# Altium schematic sheet spartan6-2.SchDoc
size 389 x 250 mm; SheetNumber: 3; SheetTotal: 8
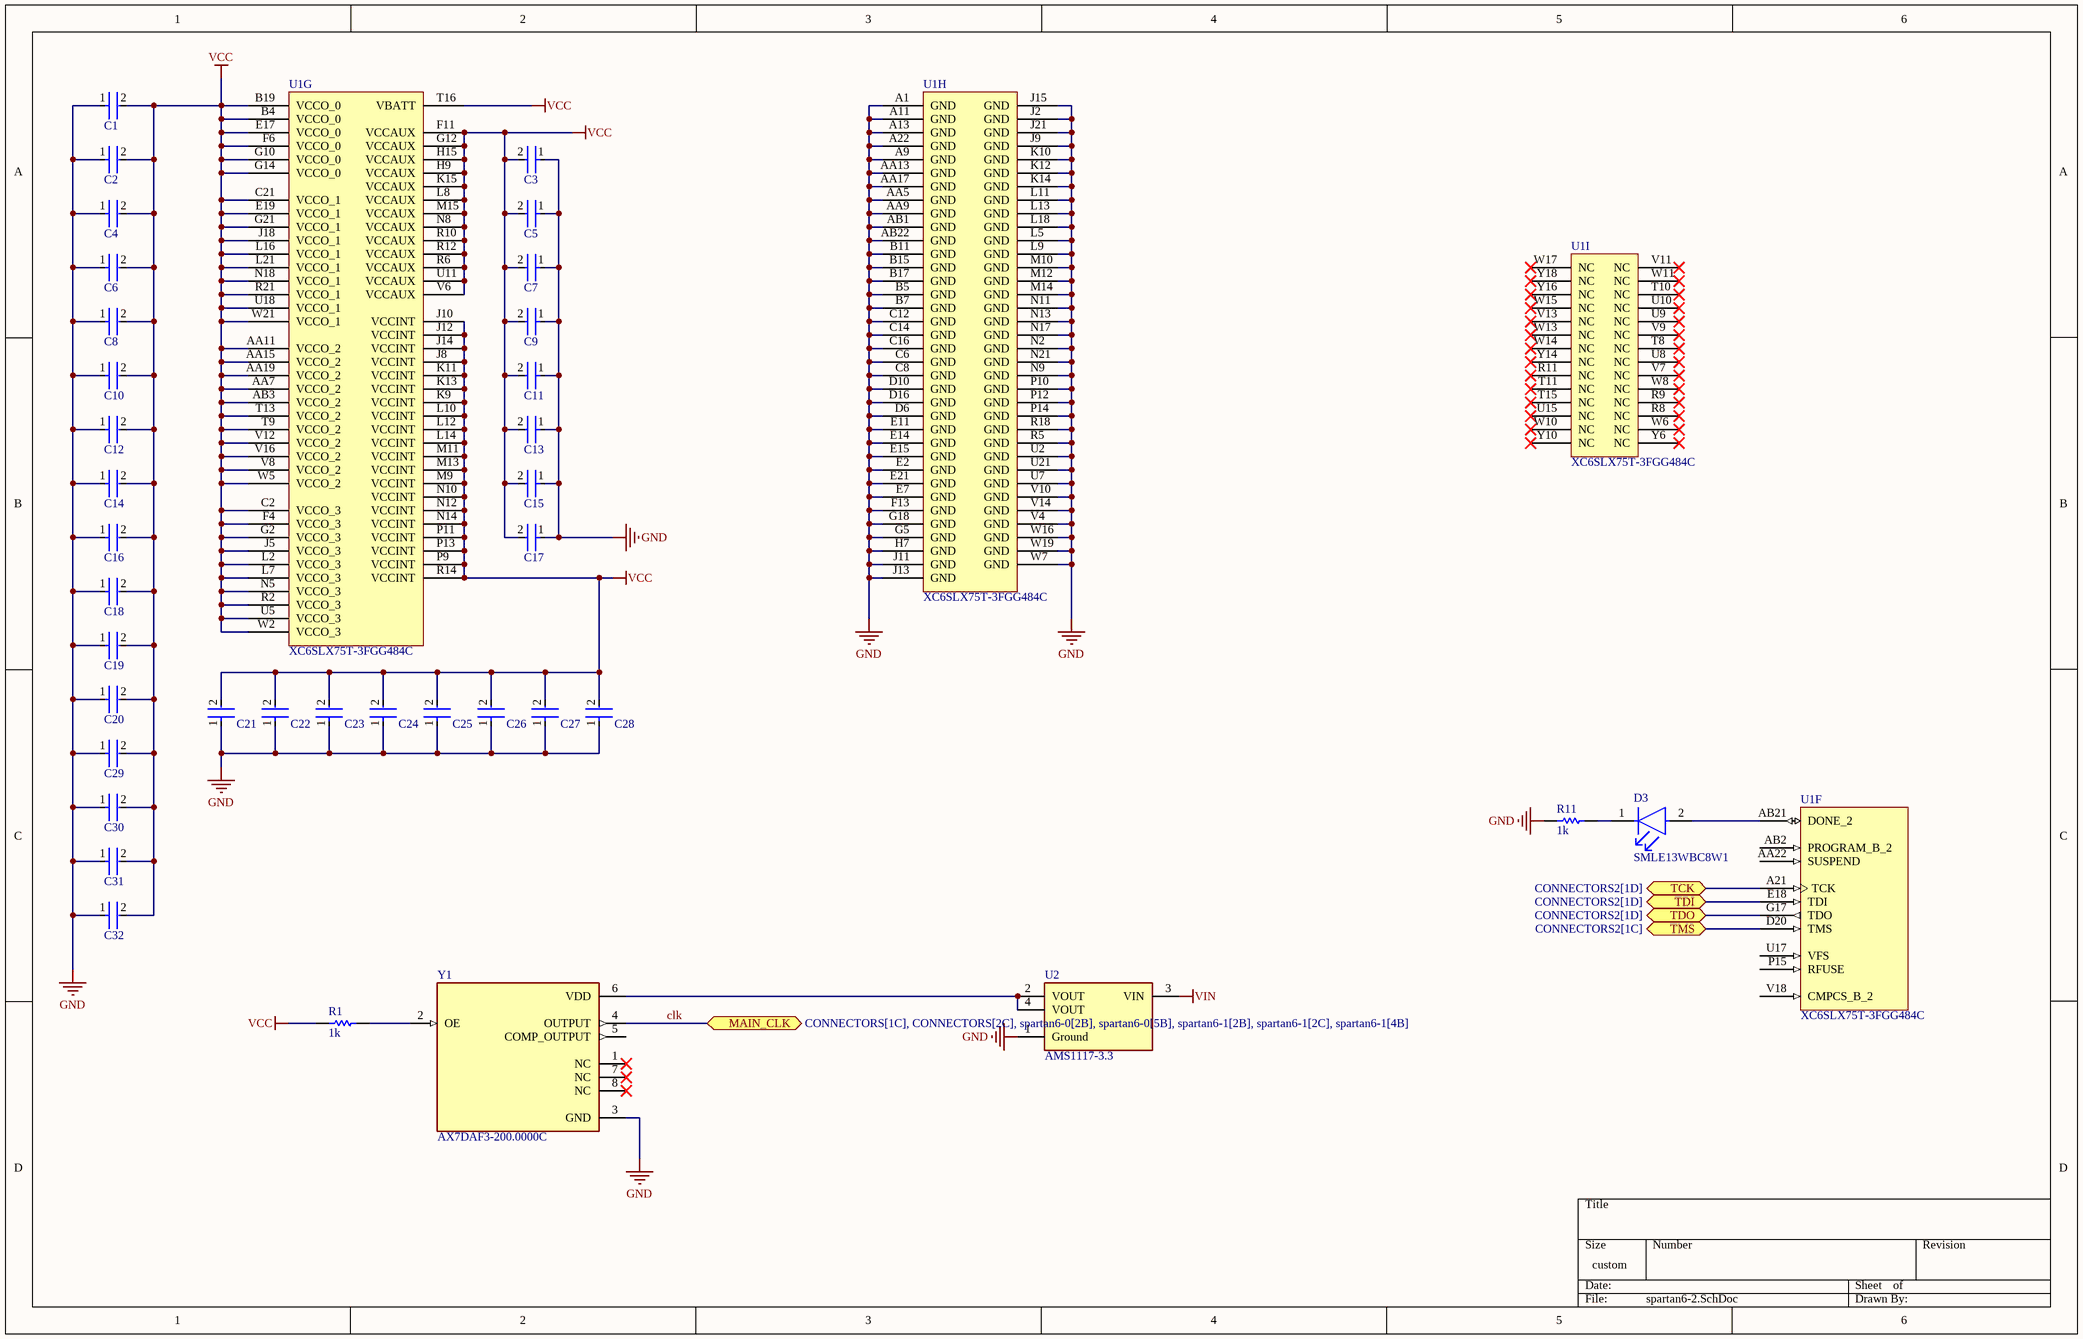
[diagram p0: spartan6-2.SchDoc]

## Parts
C1  C0603X6S0G474M030BC  [FP-C0603-030-0_03-MFG]  (value not drawn)
C2  C0603X6S0G474M030BC  [FP-C0603-030-0_03-MFG]  (value not drawn)
C3  C0603X6S0G474M030BC  [FP-C0603-030-0_03-MFG]  (value not drawn)
C4  C0603X6S0G474M030BC  [FP-C0603-030-0_03-MFG]  (value not drawn)
C5  C0603X6S0G474M030BC  [FP-C0603-030-0_03-MFG]  (value not drawn)
C6  C0603X6S0G474M030BC  [FP-C0603-030-0_03-MFG]  (value not drawn)
C7  C0603X6S0G474M030BC  [FP-C0603-030-0_03-MFG]  (value not drawn)
C8  C0603X6S0G474M030BC  [FP-C0603-030-0_03-MFG]  (value not drawn)
C9  C0603X6S0G474M030BC  [FP-C0603-030-0_03-MFG]  (value not drawn)
C10  C0603X6S0G474M030BC  [FP-C0603-030-0_03-MFG]  (value not drawn)
C11  C0603X6S0G474M030BC  [FP-C0603-030-0_03-MFG]  (value not drawn)
C12  C0603X6S0G474M030BC  [FP-C0603-030-0_03-MFG]  (value not drawn)
C13  C0603X6S0G474M030BC  [FP-C0603-030-0_03-MFG]  (value not drawn)
C14  C0603X6S0G474M030BC  [FP-C0603-030-0_03-MFG]  (value not drawn)
C15  C0603X6S0G474M030BC  [FP-C0603-030-0_03-MFG]  (value not drawn)
C16  C0603X6S0G474M030BC  [FP-C0603-030-0_03-MFG]  (value not drawn)
C17  C0603X6S0G474M030BC  [FP-C0603-030-0_03-MFG]  (value not drawn)
C18  C0603X6S0G474M030BC  [FP-C0603-030-0_03-MFG]  (value not drawn)
C19  C0603X6S0G474M030BC  [FP-C0603-030-0_03-MFG]  (value not drawn)
C20  C0603X6S0G474M030BC  [FP-C0603-030-0_03-MFG]  (value not drawn)
C21  C0603X6S0G474M030BC  [FP-C0603-030-0_03-MFG]  (value not drawn)
C22  C0603X6S0G474M030BC  [FP-C0603-030-0_03-MFG]  (value not drawn)
C23  C0603X6S0G474M030BC  [FP-C0603-030-0_03-MFG]  (value not drawn)
C24  C0603X6S0G474M030BC  [FP-C0603-030-0_03-MFG]  (value not drawn)
C25  C0603X6S0G474M030BC  [FP-C0603-030-0_03-MFG]  (value not drawn)
C26  C0603X6S0G474M030BC  [FP-C0603-030-0_03-MFG]  (value not drawn)
C27  C0603X6S0G474M030BC  [FP-C0603-030-0_03-MFG]  (value not drawn)
C28  C0603X6S0G474M030BC  [FP-C0603-030-0_03-MFG]  (value not drawn)
C29  C0603X6S0G474M030BC  [FP-C0603-030-0_03-MFG]  (value not drawn)
C30  C0603X6S0G474M030BC  [FP-C0603-030-0_03-MFG]  (value not drawn)
C31  C0603X6S0G474M030BC  [FP-C0603-030-0_03-MFG]  (value not drawn)
C32  C0603X6S0G474M030BC  [FP-C0603-030-0_03-MFG]  (value not drawn)
D3  SMLE13WBC8W1  [FP-SMLE13WBC8W1-MFG]
R1  1k  [RESC2013X60X35ML10T20]
R11  1k  [RESC2013X60X35ML10T20]
U1  XC6SLX75T-3FGG484C  [FGG484]  (parts F,G,H,I of 9)
U2  AMS1117-3.3  [FP-AMS1117-IPC_C]
Y1  AX7DAF3-200.0000C  [OSC_AX7DAF3-200.0000C]

## Ports
MAIN_CLK (bidir, see CONNECTORS[1C], CONNECTORS[2C], spartan6-0[2B], spartan6-0[5B], spartan6-1[2B], spartan6-1[2C], spartan6-1[4B]), TCK (bidir, see CONNECTORS2[1D]), TDI (bidir, see CONNECTORS2[1D]), TDO (bidir, see CONNECTORS2[1D]), TMS (bidir, see CONNECTORS2[1C])

## Nets
GND: C1.1 C2.1 C3.1 C4.1 C5.1 C6.1 C7.1 C8.1 C9.1 C10.1 C11.1 C12.1 C13.1 C14.1 C15.1 C16.1 C17.1 C18.1 C19.1 C20.1 C21.1 C22.1 C23.1 C24.1 C25.1 C26.1 C27.1 C28.1 C29.1 C30.1 C31.1 C32.1 R11.1 U1.A1(GND) U1.A9(GND) U1.A11(GND) U1.A13(GND) U1.A22(GND) U1.AA5(GND) U1.AA9(GND) U1.AA13(GND) U1.AA17(GND) U1.AB1(GND) U1.AB22(GND) U1.B5(GND) U1.B7(GND) U1.B11(GND) U1.B15(GND) U1.B17(GND) U1.C6(GND) U1.C8(GND) U1.C12(GND) U1.C14(GND) U1.C16(GND) U1.D6(GND) U1.D10(GND) U1.D16(GND) U1.E2(GND) U1.E7(GND) U1.E11(GND) U1.E14(GND) U1.E15(GND) U1.E21(GND) U1.F13(GND) U1.G5(GND) U1.G18(GND) U1.H7(GND) U1.J2(GND) U1.J9(GND) U1.J11(GND) U1.J13(GND) U1.J15(GND) U1.J21(GND) U1.K10(GND) U1.K12(GND) U1.K14(GND) U1.L5(GND) U1.L9(GND) U1.L11(GND) U1.L13(GND) U1.L18(GND) U1.M10(GND) U1.M12(GND) U1.M14(GND) U1.N2(GND) U1.N9(GND) U1.N11(GND) U1.N13(GND) U1.N17(GND) U1.N21(GND) U1.P10(GND) U1.P12(GND) U1.P14(GND) U1.R5(GND) U1.R18(GND) U1.U2(GND) U1.U7(GND) U1.U21(GND) U1.V4(GND) U1.V10(GND) U1.V14(GND) U1.W7(GND) U1.W16(GND) U1.W19(GND) U2.1(Ground) Y1.3(GND)
VCC: C1.2 C2.2 C3.2 C4.2 C5.2 C6.2 C7.2 C8.2 C9.2 C10.2 C11.2 C12.2 C13.2 C14.2 C15.2 C16.2 C17.2 C18.2 C19.2 C20.2 C21.2 C22.2 C23.2 C24.2 C25.2 C26.2 C27.2 C28.2 C29.2 C30.2 C31.2 C32.2 R1.1 U1.AA7(VCCO_2) U1.AA11(VCCO_2) U1.AA15(VCCO_2) U1.AA19(VCCO_2) U1.AB3(VCCO_2) U1.B4(VCCO_0) U1.B19(VCCO_0) U1.C2(VCCO_3) U1.C21(VCCO_1) U1.E17(VCCO_0) U1.E19(VCCO_1) U1.F4(VCCO_3) U1.F6(VCCO_0) U1.F11(VCCAUX) U1.G2(VCCO_3) U1.G10(VCCO_0) U1.G12(VCCAUX) U1.G14(VCCO_0) U1.G21(VCCO_1) U1.H9(VCCAUX) U1.H15(VCCAUX) U1.J5(VCCO_3) U1.J8(VCCINT) U1.J10(VCCINT) U1.J12(VCCINT) U1.J14(VCCINT) U1.J18(VCCO_1) U1.K9(VCCINT) U1.K11(VCCINT) U1.K13(VCCINT) U1.K15(VCCAUX) U1.L2(VCCO_3) U1.L7(VCCO_3) U1.L8(VCCAUX) U1.L10(VCCINT) U1.L12(VCCINT) U1.L14(VCCINT) U1.L16(VCCO_1) U1.L21(VCCO_1) U1.M9(VCCINT) U1.M11(VCCINT) U1.M13(VCCINT) U1.M15(VCCAUX) U1.N5(VCCO_3) U1.N8(VCCAUX) U1.N10(VCCINT) U1.N12(VCCINT) U1.N14(VCCINT) U1.N18(VCCO_1) U1.P9(VCCINT) U1.P11(VCCINT) U1.P13(VCCINT) U1.R2(VCCO_3) U1.R6(VCCAUX) U1.R10(VCCAUX) U1.R12(VCCAUX) U1.R14(VCCINT) U1.R21(VCCO_1) U1.T9(VCCO_2) U1.T13(VCCO_2) U1.T16(VBATT) U1.U5(VCCO_3) U1.U11(VCCAUX) U1.U18(VCCO_1) U1.V6(VCCAUX) U1.V8(VCCO_2) U1.V12(VCCO_2) U1.V16(VCCO_2) U1.W2(VCCO_3) U1.W5(VCCO_2) U1.W21(VCCO_1)
VIN: U2.3(VIN)
clk: Y1.4(OUTPUT) ; port MAIN_CLK
TCK: U1.A21(TCK) ; port TCK
TDI: U1.E18(TDI) ; port TDI
TDO: U1.G17(TDO) ; port TDO
TMS: U1.D20(TMS) ; port TMS
NetD3_1: D3.1(C) R11.2
NetD3_2: D3.2(A) U1.AB21(DONE_2)
NetR1_2: R1.2 Y1.2(OE)
NetU2_2: U2.2(VOUT) U2.4(VOUT) Y1.6(VDD)

Not connected (* = marked no-connect by the designer): U1 AA22(SUSPEND) AB2(PROGRAM_B_2) P15(RFUSE) R8(NC)* R9(NC)* R11(NC)* T8(NC)* T10(NC)* T11(NC)* T15(NC)* U8(NC)* U9(NC)* U10(NC)* U15(NC)* U17(VFS) V7(NC)* V9(NC)* V11(NC)* V13(NC)* V18(CMPCS_B_2) W6(NC)* W8(NC)* W10(NC)* W11(NC)* W13(NC)* W14(NC)* W15(NC)* W17(NC)* Y6(NC)* Y10(NC)* Y14(NC)* Y16(NC)* Y18(NC)*; Y1 1(NC)* 5(COMP_OUTPUT) 7(NC)* 8(NC)*

## Library data of the parts
C1-C32 = CMP-08246-002636-1: Multilayer Ceramic Capacitors 470nF ±20% 4V X6S SMD 0201; Dielectric Material: Ceramic; RoHS Compliant: Yes; Case Code (Imperial): 0201; Voltage Rating: 4V; Series: C; Case/Package: 0201; Max Operating Temperature: 105°C; Width: 0.3mm; Termination: SMD/SMT; Lead Free: Lead Free; Capacitance: 470nF; Tolerance: 20%; Mount: Surface Mount; Thickness: 0.013inch; Package Quantity: 15000; Case Code (Metric): 0603; Height: 0.3mm; Weight: 6E-06oz; Length: 0.024inch; Packaging: Tape and Reel; Min Operating Temperature: -55°C; Voltage Rating (DC): 4V; Dielectric: X6S
D3 = CMP-08952-000004-1: LED WHITE 0603 SMD; Manufacturer: Rohm; Luminous Intensity: 140mcd; Led Orientation: Top View; Reverse Voltage: 5V; Forward Voltage: 2.9V; Forward Current: 5mA; Power Dissipation: 66mW; Temperature Range Low: -40°C; Digikey Description: LED WHITE 0603 SMD; Temperature Range High: +85°C; Temperature: -40°C to +85°C; Manufacturer Part Number: SMLE13WBC8W1; Colour: White; Mouser Description: Standard LEDs - SMD ExceLED White LED 120mcd 5mA; Octopart: https://octopart.com/smle13wbc8w1-rohm-22224565; Automotive: No; Device Class L2: LEDs; Lead Free: Yes; ComponentLink2URL: https://media.digikey.com/pdf/Data%20Sheets/Rohm%20PDFs/SMLE13WBC8W1_Spec.pdf; Device Class L3: unset; Package: 0; RoHS: TRUE; Height: 0.4mm; Category: Diode; Device Class L1: Optoelectronics; ComponentLink2Description: Datasheet
R1 R11 = CMP-2100-03673-1: Chip Resistor, 0 Ohm, Jumper, +/- 5%, 0.125 W, -55 to 155 degC, 0805 (2012 Metric), RoHS, Tape and Reel; Manufacturer: Yageo; Power Rating: 125mW; Resistance: 0mOhm; Voltage Rating (DC): 150V; Temperature Coefficient: 200ppm/degreesC; Height: 0.5mm; Depth: 1.25mm; Case Code (Imperial): 0805; Lead Free: LeadFree; Military Standard: Not; Package Description: 2-Pin Surface Mounted Device, Body 2 x 1.25 mm; Case Code (Metric): 2012; Composition: ThickFilm; Voltage Rating: 150V; Manufacturer URL: http://www.yageo.com/; Packaging: TapeandReel; Package Reference: 0805; REACH SVHC: Unknown; Tolerance: 5%; Case/Package: 0805; Max Operating Temperature: 155degC; Number of Pins: 2; Min Operating Temperature: -55degC; RoHSCompliant: true; Length: 2mm; Datasheet URL: http://www.yageo.com/NewPortal/yageodocoutput?fileName=/pdf/R-Chip/PYu-RC_Group_51_RoHS_L_5.pdf; Termination: SMD/SMT; Radiation Hardening: No; Width: 1.25mm; Contact Plating: Tin; Datasheet Version: Rev. 5, 10/2016
U1 = CMP-0067-00082-1: Spartan-6 LXT 1.2V FPGA, 268 User I/Os, 484-Ball Fine-Pitch BGA (1.0mm Pitch), Speed Grade 3, Commercial Grade, Pb-Free; PackageDescription: 484-Ball Fine Pitch Ball Grid Array 1.00 mm Pitch (FGG484) - Pb-Free; PackageVersion: ver1.1, Dec-2008; DatasheetVersion: ver1.6, Nov-2010; Code_JEDEC: MS-034-AAJ-1; Code_IPC: BGA100P22X22-484; PackageReference: FGG484
U2 = CMP-209535-000001-1: LDO Voltage Regulators 1A, 3.3V; Manufacturer: Advanced Monolithic Systems; Dropout Voltage: 1.1V; Output Type: Fixed; Nominal Supply Current: 5mA; Max Power Dissipation: 1.2W; Max Supply Voltage: 15V; Number Of Outputs: 1; Standoff Height: 0.64mm; Max Junction Temp: +125°C; Height: 1.8mm; Package: AMS1117; Device Class L2: Power Management ICs; ComponentLink2Description: Datasheet; ComponentLink2URL: http://www.advanced-monolithic.com/pdf/ds1117.pdf; Category: IC; RoHS: TRUE; Automotive: No; Device Class L1: Integrated Circuits (ICs); Output Current: 1A; Device Class L3: Voltage Regulators - Linear; Temperature: -40°C to +125°C; Output Voltage: 3.3V; Manufacturer Part Number: AMS1117-3.3; Temperature Range Low: -40°C; Octopart: https://octopart.com/ams1117-3.3-advanced+monolithic+systems-25899300; Lead Free: Yes; Ipc Land Pattern Name: SOT229P700X180-4; Temperature Range High: +125°C
Y1 = AX7DAF3-200.0000C: MF: {'manufacturer': u'Abracon LLC'}; Package: None; Price: None; Value: *; MP: AX7DAF3-200.0000C; Availability: Unavailable